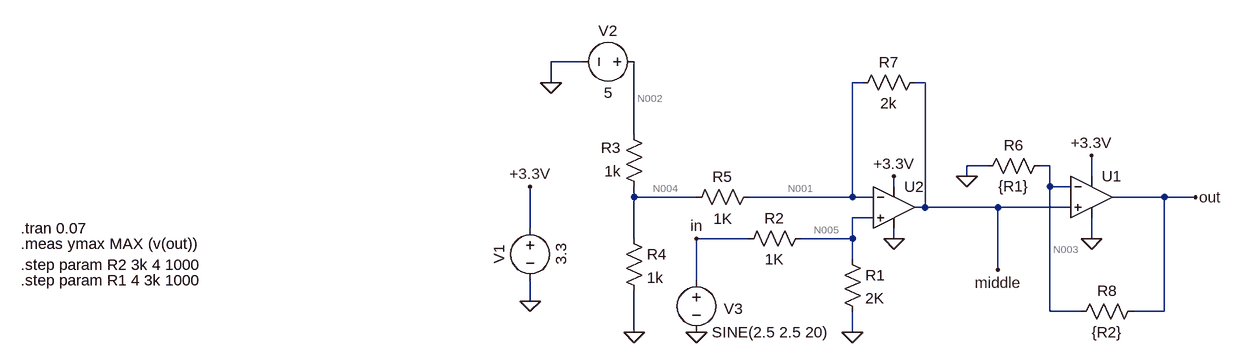
[diagram p0: schematic inverting amp with voltage repeater.asc]
inverting amp with voltage repeater.asc, the LTspice schematic file:
Version 4
SHEET 1 1004 680
WIRE -320 -48 -368 -48
WIRE -368 -16 -368 -48
WIRE 112 -16 96 -16
WIRE 208 -16 192 -16
WIRE -240 64 -240 -48
WIRE 304 112 272 112
WIRE 400 112 384 112
WIRE 272 128 272 112
WIRE 464 128 464 96
WIRE 160 144 160 128
WIRE 400 144 400 112
WIRE 432 144 400 144
WIRE -240 160 -240 144
WIRE -144 160 -240 160
WIRE 96 160 96 -16
WIRE 96 160 -64 160
WIRE 128 160 96 160
WIRE 576 160 496 160
WIRE 624 160 576 160
WIRE 208 176 208 -16
WIRE 208 176 192 176
WIRE 320 176 208 176
WIRE 432 176 320 176
WIRE 128 192 96 192
WIRE -400 208 -400 144
WIRE -240 224 -240 160
WIRE -64 224 -144 224
WIRE 96 224 96 192
WIRE 96 224 16 224
WIRE 160 224 160 208
WIRE 464 224 464 192
WIRE 96 256 96 224
WIRE 320 272 320 176
WIRE -144 288 -144 224
WIRE -400 320 -400 288
WIRE 400 336 400 144
WIRE 448 336 400 336
WIRE 576 336 576 160
WIRE 576 336 528 336
WIRE -240 368 -240 304
WIRE 96 368 96 336
FLAG -240 368 0
FLAG 272 128 0
FLAG 96 368 0
FLAG -400 320 0
FLAG -368 -16 0
FLAG -144 224 in
FLAG 624 160 out
FLAG 320 272 middle
FLAG -144 368 0
FLAG 160 224 0
FLAG 464 224 0
FLAG -400 144 +3.3V
FLAG 160 128 +3.3V
FLAG 464 96 +3.3V
SYMBOL res 80 240 R0
SYMATTR InstName R1
SYMATTR Value 2K
SYMATTR SpiceLine tol=1 pwr=0.1
SYMBOL res 32 208 R90
WINDOW 0 0 56 VBottom 2
WINDOW 3 32 56 VTop 2
SYMATTR InstName R2
SYMATTR Value 1K
SYMATTR SpiceLine tol=1 pwr=0.1
SYMBOL res -224 160 R180
WINDOW 0 36 76 Left 2
WINDOW 3 36 40 Left 2
SYMATTR InstName R3
SYMATTR Value 1k
SYMBOL res -256 208 R0
SYMATTR InstName R4
SYMATTR Value 1k
SYMBOL res -48 144 R90
WINDOW 0 0 56 VBottom 2
WINDOW 3 34 55 VTop 2
SYMATTR InstName R5
SYMATTR Value 1K
SYMATTR SpiceLine tol=1 pwr=0.1
SYMBOL res 400 96 R90
WINDOW 0 0 56 VBottom 2
WINDOW 3 32 56 VTop 2
SYMATTR InstName R6
SYMATTR Value {R1}
SYMBOL voltage -400 192 R0
WINDOW 0 -32 56 VBottom 2
WINDOW 3 32 56 VTop 2
WINDOW 123 0 0 Left 0
WINDOW 39 0 0 Left 0
SYMATTR InstName V1
SYMATTR Value 3.3
SYMBOL voltage -224 -48 R90
WINDOW 0 -32 56 VBottom 2
WINDOW 3 32 56 VTop 2
WINDOW 123 0 0 Left 0
WINDOW 39 0 0 Left 0
SYMATTR InstName V2
SYMATTR Value 5
SYMBOL voltage -144 272 R0
WINDOW 123 0 0 Left 0
WINDOW 39 0 0 Left 0
WINDOW 0 42 60 Left 2
SYMATTR InstName V3
SYMATTR Value SINE(2.5 2.5 20)
SYMBOL res 208 -32 R90
WINDOW 0 0 56 VBottom 2
WINDOW 3 32 56 VTop 2
SYMATTR InstName R7
SYMATTR Value 2k
SYMATTR SpiceLine tol=1 pwr=0.1
SYMBOL res 544 320 R90
WINDOW 0 0 56 VBottom 2
WINDOW 3 32 56 VTop 2
SYMATTR InstName R8
SYMATTR Value {R2}
SYMBOL OpAmps\\UniversalOpamp2 464 160 R0
SYMATTR InstName U1
SYMBOL OpAmps\\UniversalOpamp2 160 176 R0
SYMATTR InstName U2
TEXT -1184 208 Left 2 !.tran 0.07
TEXT -1184 232 Left 2 !.meas ymax MAX (v(out))
TEXT -1184 264 Left 2 !.step param R2 3k 4 1000
TEXT -1184 288 Left 2 !.step param R1 4 3k 1000

The netlist it stands for:
* inverting amp with voltage repeater.asc
R1 N005 0 2K tol=1 pwr=0.1
R2 N005 in 1K tol=1 pwr=0.1
R3 N004 N002 1k
R4 N004 0 1k
R5 N001 N004 1K tol=1 pwr=0.1
R6 N003 0 {R1}
V1 +3.3V 0 3.3
V2 N002 0 5
V3 in 0 SINE(2.5 2.5 20)
R7 middle N001 2k tol=1 pwr=0.1
R8 out N003 {R2}
XU1 middle N003 +3.3V 0 out level.2 Avol=1Meg GBW=10Meg Slew=10Meg ilimit=25m rail=0 Vos=0 phimargin=45 en=0 enk=0 in=0 ink=0 Rin=500Meg  ; pins IN+ IN- V+ V- OUT
XU2 N005 N001 +3.3V 0 middle level.2 Avol=1Meg GBW=10Meg Slew=10Meg ilimit=25m rail=0 Vos=0 phimargin=45 en=0 enk=0 in=0 ink=0 Rin=500Meg  ; pins IN+ IN- V+ V- OUT
.tran 0.07
.meas ymax MAX (v(out))
.step param R2 3k 4 1000
.step param R1 4 3k 1000
.lib UniversalOpamps2.sub
.backanno
.end

* Results of the author's LTspice run, read from the files saved beside the schematic
* Operating Point (first step), zero values left out:
*   r2 = 4 
*   V(n005) = 1.667 V
*   V(in) = 2.5 V
*   V(n004) = 2.222 V
*   V(n002) = 5 V
*   V(n001) = 1.667 V
*   V(n003) = 100 mV
*   V(+3.3v) = 3.3 V
*   V(middle) = 555.6 mV
*   V(out) = 200 mV
*   I(R8) = 25 mA
*   I(R7) = -555.6 µA
*   I(R6) = 25 mA
*   I(R5) = -555.6 µA
*   I(R4) = 2.222 mA
*   I(R3) = -2.778 mA
*   I(R2) = -833.3 µA
*   I(R1) = 833.3 µA
*   I(V3) = -833.3 µA
*   I(V2) = -2.778 mA
*   I(V1) = -25.03 mA
*   Ix(u1:1) = -2.189 nA
*   Ix(u1:2) = -3.1 nA
*   Ix(u1:3) = 25 mA
*   Ix(u1:4) = -100.2 nA
*   Ix(u1:5) = -25 mA
*   Ix(u2:1) = 33.33 pA
*   Ix(u2:2) = 33.34 pA
*   Ix(u2:3) = 26.22 µA
*   Ix(u2:4) = -581.8 µA
*   Ix(u2:5) = 555.6 µA
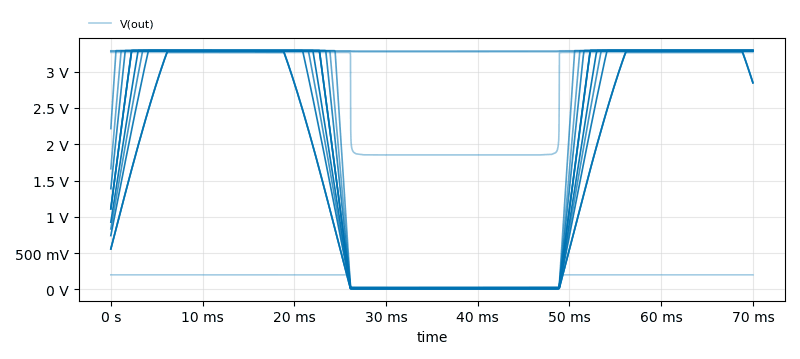
[diagram p1: Transient Analysis of inverting amp with voltage repeater.asc, plotted from the saved traces]
* Transient Analysis, 16 runs:
*   V(out) [r2=4 r1=4]: min 14.77 mV, max 200 mV, average 139.3 mV, rms 164.1 mV, last 200 mV
*   V(out) [r2=1000 r1=4]: min 1.853 V, max 3.266 V, average 2.808 V, rms 2.885 V, last 3.266 V
*   V(out) [r2=2000 r1=4]: min 3.274 V, max 3.283 V, average 3.28 V, rms 3.28 V, last 3.283 V
*   V(out) [r2=3000 r1=4]: min 3.286 V, max 3.289 V, average 3.288 V, rms 3.288 V, last 3.289 V
*   V(out) [r2=4 r1=1004]: min 7.417 mV, max 3.265 V, average 1.772 V, rms 2.29 V, last 2.853 V
*   V(out) [r2=1000 r1=1004]: min 14.74 mV, max 3.283 V, average 2.029 V, rms 2.532 V, last 3.283 V
*   V(out) [r2=2000 r1=1004]: min 22.09 mV, max 3.289 V, average 2.11 V, rms 2.602 V, last 3.289 V
*   V(out) [r2=3000 r1=1004]: min 29.44 mV, max 3.291 V, average 2.149 V, rms 2.635 V, last 3.291 V
* From the log:
*   Measurement: ymax
*     step  MAX(v(out))  FROM  TO
*        1  0.2  0  0.07
*        2  3.26611  0  0.07
*        3  3.28301  0  0.07
*        4  3.28865  0  0.07
*        5  3.26521  0  0.07
*        6  3.28301  0  0.07
*        7  3.28865  0  0.07
*        8  3.29148  0  0.07
*        9  3.28202  0  0.07
*       10  3.28865  0  0.07
*       11  3.29148  0  0.07
*       12  3.29318  0  0.07
*       13  3.28769  0  0.07
*       14  3.29147  0  0.07
*       15  3.29317  0  0.07
*       16  3.29431  0  0.07